# Altium schematic sheet CPU-board-Sheet2-multi.SchDoc: SM-CPU Board
size A3; Revision: rev. 0.1; SheetNumber: 2
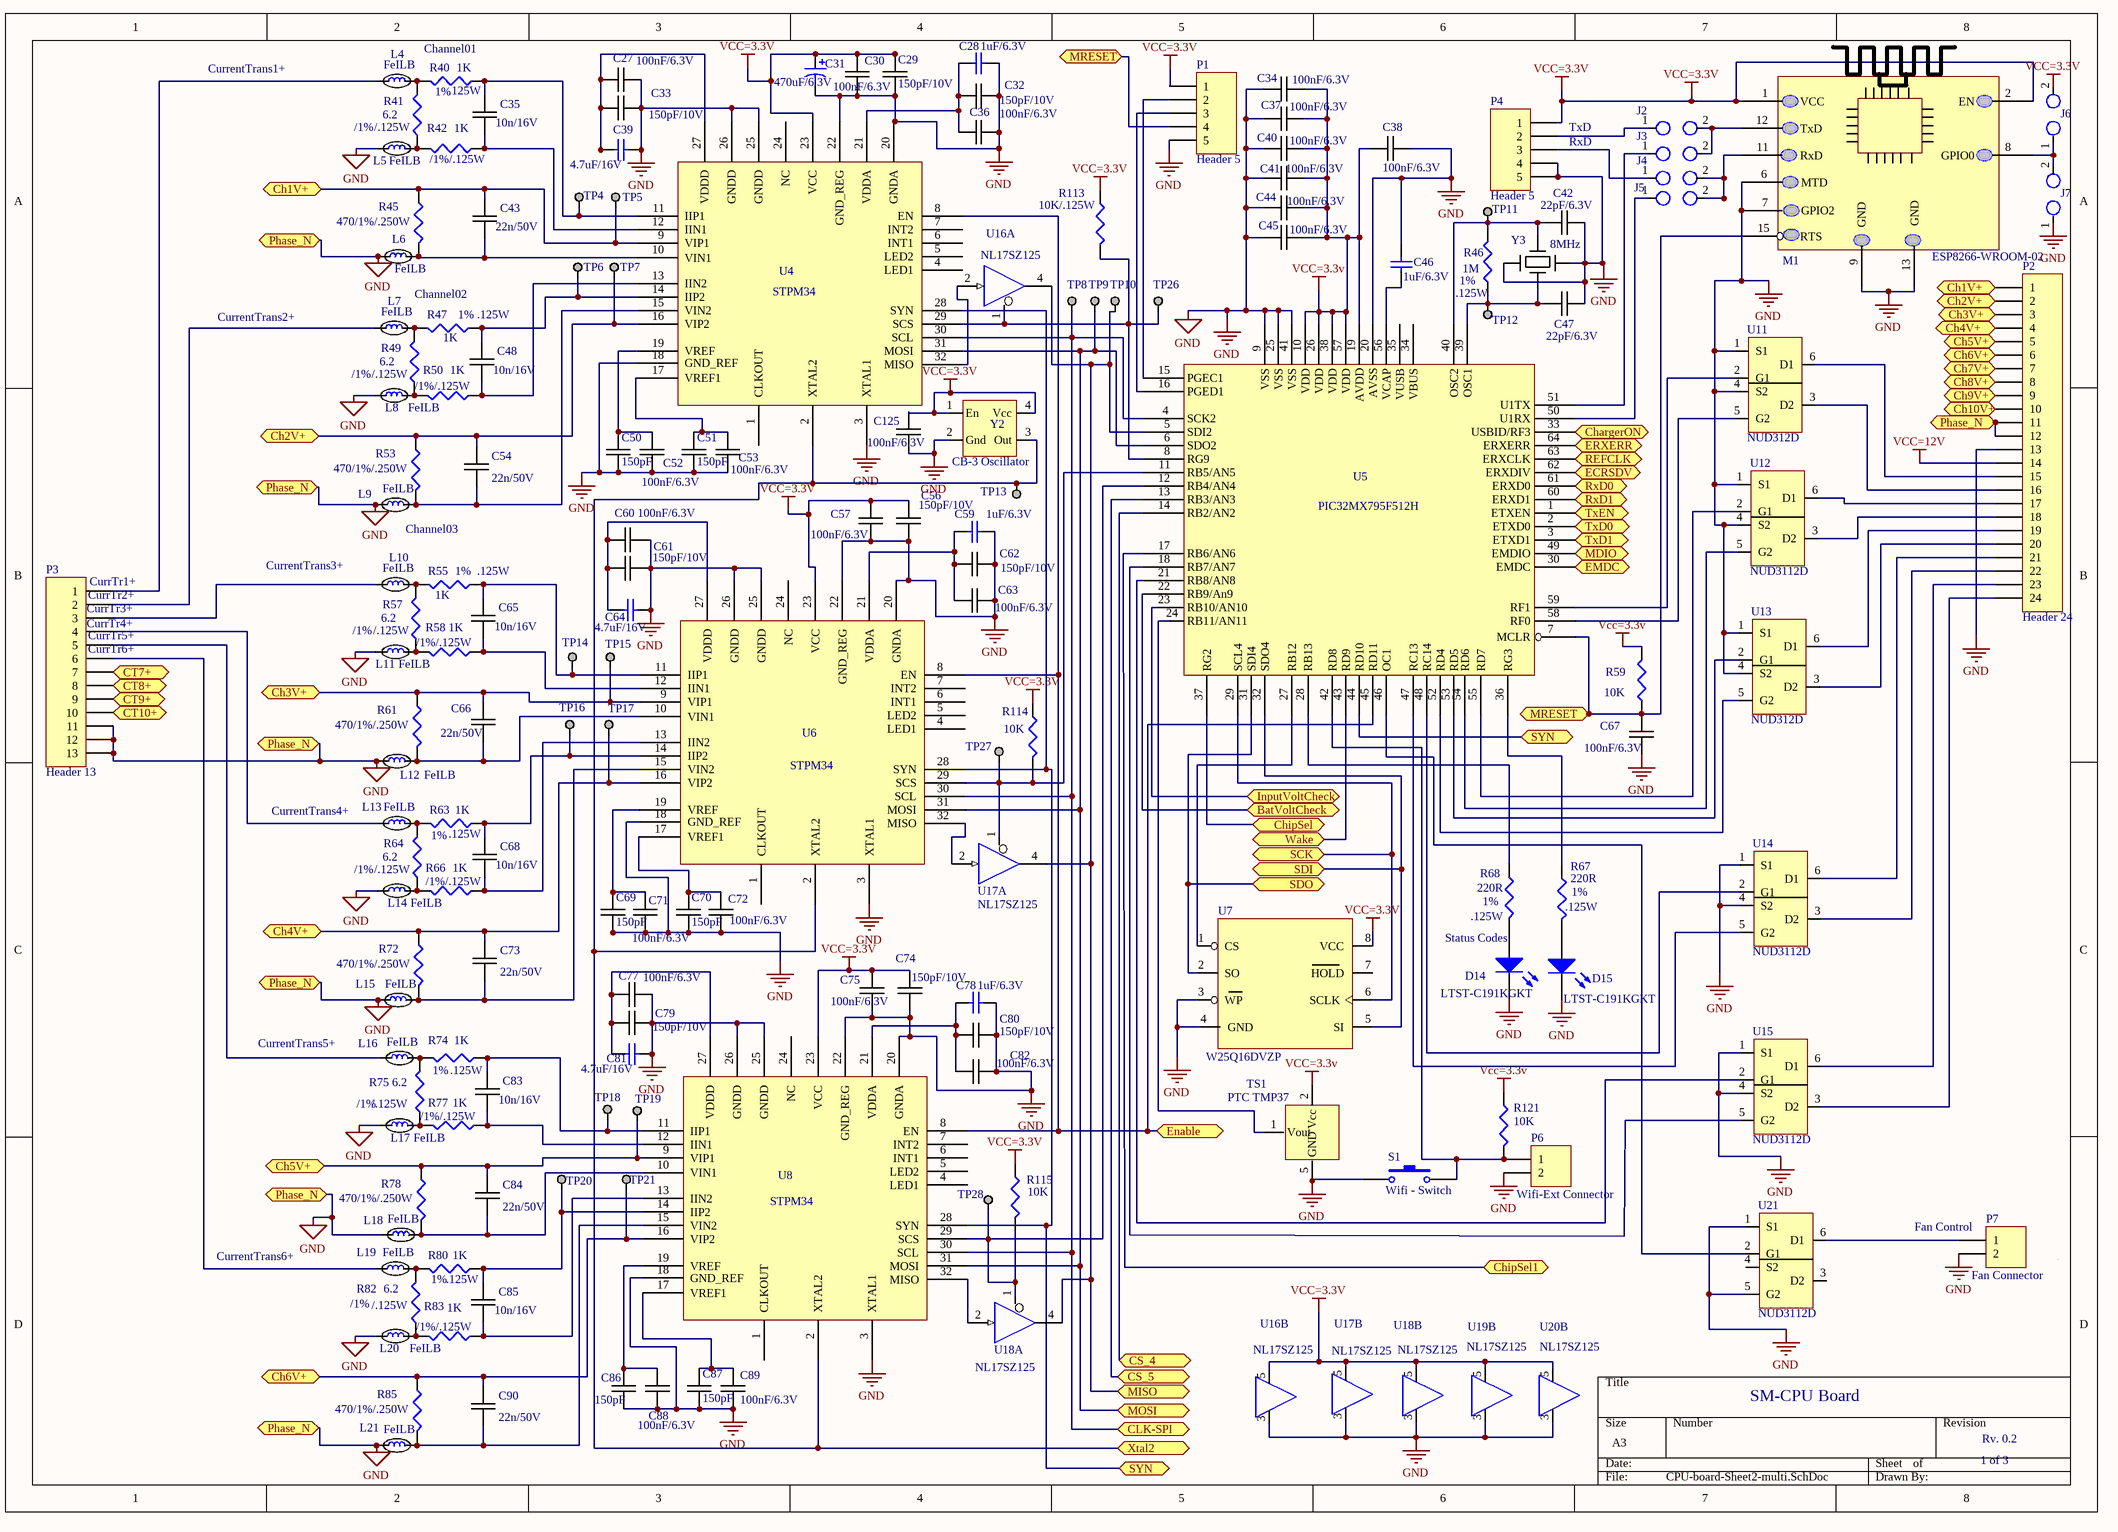
[diagram p0: CPU-board-Sheet2-multi.SchDoc]

## Parts
C27  100nF/6.3V  [0402C-GENERIC]
C28  1uF/6.3V  [0402C-GENERIC]
C29  150pF/10V  [0402C-GENERIC]
C30  100nF/6.3V  [0402C-GENERIC]
C31  470uF/6.3V  [470uF/6.3v]
C32  150pF/10V  [0402C-GENERIC]
C33  150pF/10V  [0402C-GENERIC]
C34  100nF/6.3V  [0402C-GENERIC]
C35  10n/16V  [0402C-GENERIC]
C36  100nF/6.3V  [0402C-GENERIC]
C37  100nF/6.3V  [0402C-GENERIC]
C38  100nF/6.3V  [0402C-GENERIC]
C39  4.7uF/16V  [0402C-GENERIC]
C40  100nF/6.3V  [0402C-GENERIC]
C41  100nF/6.3V  [0402C-GENERIC]
C42  22pF/6.3V  [0402C-GENERIC]
C43  22n/50V  [0402C-GENERIC]
C44  100nF/6.3V  [0402C-GENERIC]
C45  100nF/6.3V  [0402C-GENERIC]
C46  1uF/6.3V  [0402C-GENERIC]
C47  22pF/6.3V  [0402C-GENERIC]
C48  10n/16V  [0402C-GENERIC]
C50  150pF  [0402C-GENERIC]
C51  150pF  [0402C-GENERIC]
C52  100nF/6.3V  [0402C-GENERIC]
C53  100nF/6.3V  [0402C-GENERIC]
C54  22n/50V  [0402C-GENERIC]
C56  150pF/10V  [0402C-GENERIC]
C57  100nF/6.3V  [0402C-GENERIC]
C59  1uF/6.3V  [0402C-GENERIC]
C60  100nF/6.3V  [0402C-GENERIC]
C61  150pF/10V  [0402C-GENERIC]
C62  150pF/10V  [0402C-GENERIC]
C63  100nF/6.3V  [0402C-GENERIC]
C64  4.7uF/16V  [0402C-GENERIC]
C65  10n/16V  [0402C-GENERIC]
C66  22n/50V  [0402C-GENERIC]
C67  100nF/6.3V  [0402C-GENERIC]
C68  10n/16V  [0402C-GENERIC]
C69  150pF  [0402C-GENERIC]
C70  150pF  [0402C-GENERIC]
C71  100nF/6.3V  [0402C-GENERIC]
C72  100nF/6.3V  [0402C-GENERIC]
C73  22n/50V  [0402C-GENERIC]
C74  150pF/10V  [0402C-GENERIC]
C75  100nF/6.3V  [0402C-GENERIC]
C77  100nF/6.3V  [0402C-GENERIC]
C78  1uF/6.3V  [0402C-GENERIC]
C79  150pF/10V  [0402C-GENERIC]
C80  150pF/10V  [0402C-GENERIC]
C81  4.7uF/16V  [0402C-GENERIC]
C82  100nF/6.3V  [0402C-GENERIC]
C83  10n/16V  [0402C-GENERIC]
C84  22n/50V  [0402C-GENERIC]
C85  10n/16V  [0402C-GENERIC]
C86  150pF  [0402C-GENERIC]
C87  150pF  [0402C-GENERIC]
C88  100nF/6.3V  [0402C-GENERIC]
C89  100nF/6.3V  [0402C-GENERIC]
C90  22n/50V  [0402C-GENERIC]
C125  100nF/6.3V  [0402C-GENERIC]
D14  LED2  [LED-SM]  (value not drawn)
D15  LED2  [LED-SM]  (value not drawn)
J2  Header1x1  [HDR1X2]  (value not drawn)
J3  Header1x1  [HDR1X2]  (value not drawn)
J4  Header1x1  [HDR1X2]  (value not drawn)
J5  Header1x1  [HDR1X2]  (value not drawn)
J6  Header1x1  [HDR1X2]  (value not drawn)
J7  Header1x1  [HDR1X2]  (value not drawn)
L4  FeILB  [0603C-TBD]
L5  FeILB  [0603C-TBD]
L6  FeILB  [0603C-TBD]
L7  FeILB  [0603C-TBD]
L8  FeILB  [0603C-TBD]
L9  FeILB  [0603C-TBD]
L10  FeILB  [0603C-TBD]
L11  FeILB  [0603C-TBD]
L12  FeILB  [0603C-TBD]
L13  FeILB  [0603C-TBD]
L14  FeILB  [0603C-TBD]
L15  FeILB  [0603C-TBD]
L16  FeILB  [0603C-TBD]
L17  FeILB  [0603C-TBD]
L18  FeILB  [0603C-TBD]
L19  FeILB  [0603C-TBD]
L20  FeILB  [0603C-TBD]
L21  FeILB  [0603C-TBD]
M1  ESP8266-WROOM-02  [PCBComponent_1 - duplicate]
P1  Header 5  [HDR1X5]
P2  Header 24  [HDR1X24]
P3  Header 13
P4  Header 5  [HDR1X5]
P6  Wifi-Ext Connector  [HDR1X2]
P7  Fan Connector  [HDR1X2]
R40  1K  [0402R-TBD]
R41  6.2  [0402R-TBD]
R42  1K  [0402R-TBD]
R45  470/1%/.250W  [1206FB-GENERIC]
R46  1M  [0402R-TBD]
R47  1K  [0402R-TBD]
R49  6.2  [0402R-TBD]
R50  1K  [0402R-TBD]
R53  470/1%/.250W  [1206FB-GENERIC]
R55  1K  [0402R-TBD]
R57  6.2  [0402R-TBD]
R58  1K  [0402R-TBD]
R59  10K  [0402R-TBD]
R61  470/1%/.250W  [1206FB-GENERIC]
R63  1K  [0402R-TBD]
R64  6.2  [0402R-TBD]
R66  1K  [0402R-TBD]
R67  220R  [0402R-TBD]
R68  220R  [0402R-TBD]
R72  470/1%/.250W  [1206FB-GENERIC]
R74  1K  [0402R-TBD]
R75  6.2  [0402R-TBD]
R77  1K  [0402R-TBD]
R78  470/1%/.250W  [1206FB-GENERIC]
R80  1K  [0402R-TBD]
R82  6.2  [0402R-TBD]
R83  1K  [0402R-TBD]
R85  470/1%/.250W  [1206FB-GENERIC]
R113  10K/.125W  [0402C-GENERIC]
R114  10K  [0402C-GENERIC]
R115  10K  [0402C-GENERIC]
R121  10K  [0402R-TBD]
S1  Wifi - Switch  [SPST-2]
TP4  TESTPOINT  [TESTPOINT]  (value not drawn)
TP5  TESTPOINT  [TESTPOINT]  (value not drawn)
TP6  TESTPOINT  [TESTPOINT]  (value not drawn)
TP7  TESTPOINT  [TESTPOINT]  (value not drawn)
TP8  TESTPOINT  [TESTPOINT]  (value not drawn)
TP9  TESTPOINT  [TESTPOINT]  (value not drawn)
TP10  TESTPOINT  [TESTPOINT]  (value not drawn)
TP11  TESTPOINT  [TESTPOINT]  (value not drawn)
TP12  TESTPOINT  [TESTPOINT]  (value not drawn)
TP13  TESTPOINT  [TESTPOINT]  (value not drawn)
TP14  TESTPOINT  [TESTPOINT]  (value not drawn)
TP15  TESTPOINT  [TESTPOINT]  (value not drawn)
TP16  TESTPOINT  [TESTPOINT]  (value not drawn)
TP17  TESTPOINT  [TESTPOINT]  (value not drawn)
TP18  TESTPOINT  [TESTPOINT]  (value not drawn)
TP19  TESTPOINT  [TESTPOINT]  (value not drawn)
TP20  TESTPOINT  [TESTPOINT]  (value not drawn)
TP21  TESTPOINT  [TESTPOINT]  (value not drawn)
TP26  TESTPOINT  [TESTPOINT]  (value not drawn)
TP27  TESTPOINT  [TESTPOINT]  (value not drawn)
TP28  TESTPOINT  [TESTPOINT]  (value not drawn)
TS1  PTC TMP37
U4  STPM34  [QFN32_L]
U5  PIC32MX795F512H  [QFN64_N]
U6  STPM34  [QFN32_L]
U7  W25Q16DVZP  [SO8_L]
U8  STPM34  [QFN32_L]
U11  NUD312D  [NUD3112D]
U12  NUD3112D  [NUD3112D]
U13  NUD312D  [NUD3112D]
U14  NUD3112D  [NUD3112D]
U15  NUD3112D  [NUD3112D]
U16  NL17SZ125  (parts A,B of 2)
U17  NL17SZ125  (parts A,B of 2)
U18  NL17SZ125  (parts A,B of 2)
U19  NL17SZ125  (part B of 2)
U20  NL17SZ125  (part B of 2)
U21  NUD3112D  [NUD3112D]
Y2  CB-3 Oscillator  [CB3-16MHZ]
Y3  8MHz  [CeramicResonator8-16MHZ]

## Ports
BatVoltCheck, Ch1V+, Ch2V+, Ch3V+, Ch4V+, Ch5V+, Ch6V+, Ch7V+, Ch8V+, Ch9V+, Ch10V+, ChargerON, ChipSel, ChipSel1, CLK-SPI, CS_4, CS_5, CT7+, CT8+, CT9+, CT10+, ECRSDV, EMDC, Enable, ERXERR, InputVoltCheck, MDIO, MISO, MOSI, MRESET, Phase_N, REFCLK, RxD0, RxD1, SCK, SDI, SDO, SYN, TxD0, TxD1, TxEN, Wake, Xtal2

## Nets
GND: C27.2 C28.2 C29.2 C30.2 C31.2 C32.2 C33.2 C34.1 C36.2 C37.1 C38.2 C39.2 C40.1 C41.1 C42.2 C44.1 C45.1 C46.2 C47.2 C50.2 C51.2 C52.1 C53.2 C56.2 C57.2 C59.2 C60.2 C61.2 C62.2 C63.2 C64.2 C67.2 C69.2 C70.2 C71.2 C72.2 C74.2 C75.2 C77.2 C78.2 C79.2 C80.2 C81.2 C82.2 C86.2 C87.2 C88.2 C89.2 C125.1 D14.2(K) D15.2(K) J7.1 L5.1 L6.1 L8.1 L9.1 L11.1 L12.1 L14.1 L15.1 L17.1 L18.1 L20.1 L21.1 M1.6(MTD) M1.7(GPIO2) M1.9(GND) M1.13(GND) P1.5 P2.11 P2.12 P2.13 P3.11 P3.12 P3.13 P4.4 P4.5 P6.2 P7.2 S1.1 TS1.5(GND) U4.3(XTAL1) U4.18(GND_REF) U4.20(GNDA) U4.22(GND_REG) U4.25(GNDD) U4.26(GNDD) U5.9(VSS) U5.20(AVSS) U5.25(VSS) U5.41(VSS) U6.3(XTAL1) U6.18(GND_REF) U6.20(GNDA) U6.22(GND_REG) U6.25(GNDD) U6.26(GNDD) U7.3(WP) U7.4(GND) U8.3(XTAL1) U8.18(GND_REF) U8.20(GNDA) U8.22(GND_REG) U8.25(GNDD) U8.26(GNDD) U11.1(S1) U11.4(S2) U12.1(S1) U12.4(S2) U13.1(S1) U13.4(S2) U14.1(S1) U14.4(S2) U15.1(S1) U15.4(S2) U16.3 U17.3 U18.3 U19.3 U20.3 U21.1(S1) U21.5(G2) Y2.2(Gnd) Y3.2 Y3.4 ; port Phase_N
VCC=3.3V: C29.1 C30.1 C31.1 C34.2 C37.2 C38.1 C40.2 C41.2 C44.2 C45.2 C56.1 C57.1 C74.1 C75.1 C125.2 J6.2 M1.1(VCC) M1.2(EN) P1.1 P4.1 R59.2 R113.1 R114.1 R115.1 R121.1 TS1.2(Vcc) U4.23(VCC) U5.10(VDD) U5.19(AVDD) U5.26(VDD) U5.38(VDD) U5.57(VDD) U6.23(VCC) U7.8(VCC) U8.23(VCC) U16.5 U17.5 U18.5 U19.5 U20.5 Y2.1(En) Y2.4(Vcc)
VCC=12V: P2.14
BatVoltCheck: U5.22(RB9/An9) ; port BatVoltCheck
Ch1V+: C43.2 P2.1 R45.1 TP5.1 U4.9(VIP1) ; port Ch1V+
Ch2V+: C54.2 P2.2 R53.1 TP7.1 U4.16(VIP2) ; port Ch2V+
Ch3V+: C66.2 P2.3 R61.1 TP15.1 U6.9(VIP1) ; port Ch3V+
Ch4V+: C73.2 P2.4 R72.1 TP17.1 U6.16(VIP2) ; port Ch4V+
Ch5V+: C84.2 P2.5 R78.1 TP19.1 U8.9(VIP1) ; port Ch5V+
Ch6V+: C90.2 P2.6 R85.1 TP21.1 U8.16(VIP2) ; port Ch6V+
Ch7V+: P2.7 ; port Ch7V+
Ch8V+: P2.8 ; port Ch8V+
Ch9V+: P2.9 ; port Ch9V+
Ch10V+: P2.10 ; port Ch10V+
ChargerON: U5.33(USBID/RF3) ; port ChargerON
ChipSel: U5.37(RG2) ; port ChipSel
ChipSel1: U5.17(RB6/AN6) ; port ChipSel1
CLK-SPI: TP8.1 U4.30(SCL) U5.4(SCK2) U6.30(SCL) U8.30(SCL) ; port CLK-SPI
CS_4: U5.14(RB2/AN2) ; port CS_4
CS_5: U5.13(RB3/AN3) ; port CS_5
CT7+: P3.7 ; port CT7+
CT8+: P3.8 ; port CT8+
CT9+: P3.9 ; port CT9+
CT10+: P3.10 ; port CT10+
ECRSDV: U5.62(ERXDIV) ; port ECRSDV
EMDC: U5.30(EMDC) ; port EMDC
Enable: U4.8(EN) U6.8(EN) U8.8(EN) ; port Enable
ERXERR: U5.64(ERXERR) ; port ERXERR
InputVoltCheck: U5.23(RB10/AN10) ; port InputVoltCheck
MDIO: U5.49(EMDIO) ; port MDIO
MISO: TP10.1 U5.5(SDI2) U16.4(Y) U17.4(Y) U18.4(Y) ; port MISO
MOSI: TP9.1 U4.31(MOSI) U5.6(SDO2) U6.31(MOSI) U8.31(MOSI) ; port MOSI
MRESET: C67.1 M1.15(RTS) P1.4 R59.1 U5.7(MCLR) ; port MRESET
REFCLK: U5.63(ERXCLK) ; port REFCLK
RxD0: U5.61(ERXD0) ; port RxD0
RxD1: U5.60(ERXD1) ; port RxD1
SCK: U5.29(SCL4) U7.6(SCLK) ; port SCK
SDI: U5.32(SDO4) U7.5(SI) ; port SDI
SDO: U5.31(SDI4) U7.2(SO) ; port SDO
SYN: U4.28(SYN) U5.44(RD10) U6.28(SYN) U8.28(SYN) ; port SYN
TxD0: U5.2(ETXD0) ; port TxD0
TxD1: U5.3(ETXD1) ; port TxD1
TxEN: U5.1(ETXEN) ; port TxEN
Wake: U5.43(RD9) ; port Wake
Xtal2: TP13.1 U4.2(XTAL2) U6.2(XTAL2) U8.2(XTAL2) Y2.3(Out) ; port Xtal2
NetC27_1: C27.1 C33.1 C39.1 U4.27(VDDD)
NetC28_1: C28.1 C32.1 C36.1 U4.21(VDDA)
NetC35_1: C35.1 R42.1 U4.12(IIN1)
NetC35_2: C35.2 R40.1 TP4.1 U4.11(IIP1)
NetC42_1: C42.1 R46.2 TP11.1 U5.40(OSC2) Y3.1
NetC43_1: C43.1 L6.2 R45.2 U4.10(VIN1)
NetC46_1: C46.1 U5.56(VCAP)
NetC47_1: C47.1 R46.1 TP12.1 U5.39(OSC1) Y3.3
NetC48_1: C48.1 R50.1 U4.13(IIN2)
NetC48_2: C48.2 R47.1 TP6.1 U4.14(IIP2)
NetC50_1: C50.1 C52.2 U4.19(VREF)
NetC51_1: C51.1 C53.1 U4.17(VREF1)
NetC54_1: C54.1 L9.2 R53.2 U4.15(VIN2)
NetC59_1: C59.1 C62.1 C63.1 U6.21(VDDA)
NetC60_1: C60.1 C61.1 C64.1 U6.27(VDDD)
NetC65_1: C65.1 R58.1 U6.12(IIN1)
NetC65_2: C65.2 R55.1 TP14.1 U6.11(IIP1)
NetC66_1: C66.1 L12.2 R61.2 U6.10(VIN1)
NetC68_1: C68.1 R66.1 U6.13(IIN2)
NetC68_2: C68.2 R63.1 TP16.1 U6.14(IIP2)
NetC69_1: C69.1 C71.1 U6.19(VREF)
NetC70_1: C70.1 C72.1 U6.17(VREF1)
NetC73_1: C73.1 L15.2 R72.2 U6.15(VIN2)
NetC77_1: C77.1 C79.1 C81.1 U8.27(VDDD)
NetC78_1: C78.1 C80.1 C82.1 U8.21(VDDA)
NetC83_1: C83.1 R77.1 U8.12(IIN1)
NetC83_2: C83.2 R74.1 TP18.1 U8.11(IIP1)
NetC84_1: C84.1 L18.2 R78.2 U8.10(VIN1)
NetC85_1: C85.1 R83.1 U8.13(IIN2)
NetC85_2: C85.2 R80.1 TP20.1 U8.14(IIP2)
NetC86_1: C86.1 C88.1 U8.19(VREF)
NetC87_1: C87.1 C89.1 U8.17(VREF1)
NetC90_1: C90.1 L21.2 R85.2 U8.15(VIN2)
NetD14_1: D14.1(A) R68.2
NetD15_1: D15.1(A) R67.2
NetJ2_1: J2.1 P4.2
NetJ2_2: J2.2 J3.2 M1.12(TxD)
NetJ3_1: J3.1 U5.51(U1TX)
NetJ4_1: J4.1 P4.3
NetJ4_2: J4.2 J5.2 M1.11(RxD)
NetJ5_1: J5.1 U5.50(U1RX)
NetJ6_1: J6.1 J7.2 M1.8(GPIO0)
NetL4_1: L4.1 P3.1
NetL4_2: L4.2 R40.2 R41.2
NetL5_2: L5.2 R41.1 R42.2
NetL7_1: L7.1 P3.2
NetL7_2: L7.2 R47.2 R49.2
NetL8_2: L8.2 R49.1 R50.2
NetL10_1: L10.1 P3.3
NetL10_2: L10.2 R55.2 R57.2
NetL11_2: L11.2 R57.1 R58.2
NetL13_1: L13.1 P3.4
NetL13_2: L13.2 R63.2 R64.2
NetL14_2: L14.2 R64.1 R66.2
NetL16_1: L16.1 P3.5
NetL16_2: L16.2 R74.2 R75.2
NetL17_2: L17.2 R75.1 R77.2
NetL19_1: L19.1 P3.6
NetL19_2: L19.2 R80.2 R82.2
NetL20_2: L20.2 R82.1 R83.2
NetP1_2: P1.2 U5.15(PGEC1)
NetP1_3: P1.3 U5.16(PGED1)
NetP2_15: P2.15 U11.6(D1)
NetP2_16: P2.16 U11.3(D2)
NetP2_17: P2.17 U12.6(D1)
NetP2_18: P2.18 U12.3(D2)
NetP2_19: P2.19 U13.6(D1)
NetP2_20: P2.20 U13.3(D2)
NetP2_21: P2.21 U14.6(D1)
NetP2_22: P2.22 U14.3(D2)
NetP2_23: P2.23 U15.6(D1)
NetP2_24: P2.24 U15.3(D2)
NetP6_1: P6.1 R121.2 S1.2 U5.42(RD8)
NetP7_1: P7.1 U21.6(D1)
NetR67_1: R67.1 U5.36(RG3)
NetR68_1: R68.1 U5.28(RB13)
NetR113_2: R113.2 TP26.1 U4.29(SCS) U5.8(RG9) U16.1
NetR114_2: R114.2 TP27.1 U5.11(RB5/AN5) U6.29(SCS) U17.1
NetR115_2: R115.2 TP28.1 U5.12(RB4/AN4) U8.29(SCS) U18.1
NetTS1_1: TS1.1(Vout) U5.24(RB11/AN11)
NetU4_32: U4.32(MISO) U16.2(B)
NetU5_18: U5.18(RB7/AN7) U15.5(G2)
NetU5_21: U5.21(RB8/AN8) U15.2(G1)
NetU5_27: U5.27(RB12) U7.1(CS)
NetU5_46: U5.46(OC1) U21.2(G1)
NetU5_47: U5.47(RC13) U14.5(G2)
NetU5_48: U5.48(RC14) U14.2(G1)
NetU5_52: U5.52(RD4) U13.5(G2)
NetU5_53: U5.53(RD5) U13.2(G1)
NetU5_54: U5.54(RD6) U12.5(G2)
NetU5_55: U5.55(RD7) U12.2(G1)
NetU5_58: U5.58(RF0) U11.5(G2)
NetU5_59: U5.59(RF1) U11.2(G1)
NetU6_32: U6.32(MISO) U17.2(B)
NetU8_32: U8.32(MISO) U18.2(B)

Not connected (* = marked no-connect by the designer): U4 1(CLKOUT) 4(LED1) 5(LED2) 6(INT1) 7(INT2) 24(NC); U5 34(VBUS) 35(VUSB) 45(RD11); U6 1(CLKOUT) 4(LED1) 5(LED2) 6(INT1) 7(INT2) 24(NC); U7 7(HOLD); U8 1(CLKOUT) 4(LED1) 5(LED2) 6(INT1) 7(INT2) 24(NC); U21 3(D2) 4(S2)

## Notes on the sheet
- Channel01
- CurrentTrans1+
- (near R40) 1%
- (near R40) .125W
- (near L5) /1%
- /.125W
- (near R42) /1%/.125W
- (near P4) TxD
- (near P4) RxD
- CurrentTrans2+
- Channel02
- (near R47) 1%
- (near R47) .125W
- (near R46) .125W
- (near R46) 1%
- (near L8) /1%
- /1%/.125W
- (near P3) CurrTr1+
- (near L10) CurrentTrans3+
- (near L9) Channel03
- (near R55) 1%
- (near R55) .125W
- (near P3) CurrTr3+
- (near P3) CurrTr4+
- (near P3) CurrTr2+
- (near P3) CurrTr5+
- (near P3) CurrTr6+
- (near L11) /1%
- (near L13) CurrentTrans4+
- 1%
- .125W
- (near L14) /1%
- (near R66) /1%/.125W
- (near R68) .125W
- (near R68) 1%
- (near R67) .125W
- (near R67) 1%
- (near D14) LTST-C191KGKT
- Status Codes
- CurrentTrans5+
- (near D15) LTST-C191KGKT
- (near L17) /1%
- CurrentTrans6+
- (near P7) Fan Control
- /1%
- (near R82) /.125W
- (near R80) 1%
- SM-CPU Board
- 1 of 3
- Rv. 0.2

## Library data of the parts
C27 C30 C34 C36-C38 C40 C41 C44 C45 C52 C53 C57 C60 C63 C67 C71 C72 C75 C77 C82 C88 C89 C125 = 0805C-18PF-50V-C0G-JOH: CAPACITOR 0805 CERAMIC; mfr PN: LMK105BJ104KV-F; Manufacturer: Taiyo Yuden; Mfr.PN#: CRM155R71H103KA880; Value: 100nF/16V; Suppl.PN#: 587-1227-1-ND; Supplier 1: Digi-Key; Supplier Part Number 1: 709-1171-2-ND; Package reference: 0805-TBD; Supplier: Digi-Key; PackageReference: 0402; Price: .002
C28 C46 C59 C78 = Cap: Capacitor; Manufacturer: Murata; Mfr.PN#: GRM155R60J105KE19D; Value: 1uF; Suppl.PN#: 490-1320-1-ND; Published: 8-Jun-2000; LatestRevisionDate: 17-Jul-2002; LatestRevisionNote: Re-released for DXP Platform.; PackageReference: 0402; Publisher: Altium Limited; PackageDescription: Radial Cap, Thru-Hole; 2 Leads; 0.3 in Pin Spacing; Supplier: DigiKey
C29 C32 C33 C56 C61 C62 C74 C79 C80 = 0805C-18PF-50V-C0G-JOH: CAPACITOR 0805 CERAMIC; Manufacturer: Wurth Electronics; Mfr.PN#: 885012005014; Suppl.PN#: 732-7432-1-ND; Supplier 1: Digi-Key; Supplier Part Number 1: 709-1171-2-ND; Value: 150pF/10V; mfr PN: *; Supplier: Digi-Key; Price: .002
  C29 C33: PackageReference: 0402; smd: 0402
  C32: Package reference: 0805-TBD; smd: 0402
  C56 C61 C62 C74 C79 C80: Package reference: 0805-TBD; PackageReference: 0402
C31 = Cap Pol3: Polarized Capacitor (Surface Mount); Manufacturer: Nichicon; Mfr.PN#: RL80J471MDNASQKX; Value: 100uF/10v; Suppl.PN#: 493-4019-3-ND; Published: 8-Jun-2000; LatestRevisionDate: 29-May-2009; LatestRevisionNote: IPC-7351 Footprint Added.; PackageReference: Radial Can; Publisher: Altium Limited; PackageDescription: Chip Capacitor; Supplier: Digi-Key; SMD: 1206; Price: .065
C35 C48 C65 C68 C83 C85 = 0805C-18PF-50V-C0G-JOH: CAPACITOR 0805 CERAMIC; Manufacturer: Murata Electronics; Mfr.PN#: GRM155R71C103KA01D; Value: 10n; Suppl.PN#: 490-1313-1-ND; Supplier 1: Digi-Key; Supplier Part Number 1: 709-1171-2-ND; mfr PN: *; PackageReference: 0402; Supplier: Digi-Key; Price: .002
  C35 C68 C83 C85: Suppl.PN#: GRM155R71C103KA01D; smd: 0402
  C48: Package reference: 0402; Suppl.PN#: GRM155R71C103KA01D
  C65: Package reference: 0805-TBD
C39 C64 C81 = Cap: Capacitor; Manufacturer: Samsung; Mfr.PN#: CL05A475MO5NUNC; Value: 1uF; Suppl.PN#: 1276-6836-1-ND; Published: 8-Jun-2000; LatestRevisionDate: 17-Jul-2002; LatestRevisionNote: Re-released for DXP Platform.; PackageReference: 0402; Publisher: Altium Limited; PackageDescription: Radial Cap, Thru-Hole; 2 Leads; 0.3 in Pin Spacing; Supplier: DigiKey
C42 = 0805C-18PF-50V-C0G-JOH: CAPACITOR 0805 CERAMIC; Manufacturer: Murata; Mfr.PN#: GRM1555C1E120JA01D; Suppl.PN#: 490-8170-1-ND; Supplier 1: Digi-Key; Supplier Part Number 1: 709-1171-2-ND; Supplier: DigiKey; PackageReference: 0402
C43 C54 C66 C73 C84 C90 = 0805C-18PF-50V-C0G-JOH: CAPACITOR 0805 CERAMIC; Manufacturer: Murata Electronics; Mfr.PN#: GRM155R71H223KA12D; Value: 10n; Suppl.PN#: 490-3884-1-ND; Supplier 1: Digi-Key; Supplier Part Number 1: 709-1171-2-ND; mfr PN: *; Package reference: 0402; Supplier: Digi-Key; PackageReference: 0402; Price: .002
C47 = 0805C-18PF-50V-C0G-JOH: CAPACITOR 0805 CERAMIC; Manufacturer: Murata; Mfr.PN#: GRM1555C1E120JA01D; Suppliier: DigiKey; Suppl.PN#: 490-8170-1-ND; Supplier 1: Digi-Key; Supplier Part Number 1: 709-1171-2-ND; PackageReference: 0402
C50 C51 C69 C70 C86 C87 = 0805C-18PF-50V-C0G-JOH: CAPACITOR 0805 CERAMIC; Manufacturer: Wurth Electronics; Mfr.PN#: 885012005014; Value: 150pF/10V; Suppl.PN#: 732-7432-1-ND; Supplier 1: Digi-Key; Supplier Part Number 1: 709-1171-2-ND; mfr PN: *; PackageReference: 0402; Supplier: Digi-Key; smd: 0402; Price: .002
D14 D15 = LED2: Typical RED, GREEN, YELLOW, AMBER GaAs LED; Manufacturer: Lite-On Inc; Mfr.PN#: LTST-C191KGKT; Suppl.PN#: 160-1446-2-ND; Published: 8-Jun-2000; LatestRevisionDate: 17-Jul-2002; LatestRevisionNote: Re-released for DXP Platform.; PackageVersion: Feb-2002; PackageReference: 0603; Publisher: Altium Limited; PackageDescription: SM LED; 2 Flat Leads; Supplier: Digi-Key; Price: .04
J2-J7 = Header1x1: Suppl.PN#: S9014E-05-ND; Supplier: Digikey
L4-L21 = FerrBeads/ILBB: Manufacturer: Brand Samsung; Mfr.PN#: C1M10J152NC; Suppl.PN#: 1276-6326-1-ND; Supplier: Digi-Key; Price: .027
  L4-L7: PackageReference: 0603
M1 = ESP 8266: Supplier: Alixpress; Suppl.PN#: ESP8266-WROOM-02; Link: https://www.aliexpress.com/store/product/ESP8266-serial-WIFI-model-ESP-WROOM-02-Authenticity-Guaranteed/431798_32319251013.html
P1 P4 = Header 5: Header, 5-Pin; Suppl.PN#: S9014E-05-ND; LatestRevisionDate: 17-Jul-2002; LatestRevisionNote: Re-released for DXP Platform.; Publisher: Altium Limited; Supplier: Optional depend of debugger; Supplier: Digikey
P2 = Header 24: Header, 24-Pin; Manufacturer: Sullins Connector Solution; Mfr.PN#: PPPC241LFBN-RC; Suppl.PN#: S7057-ND; LatestRevisionDate: 17-Jul-2002; LatestRevisionNote: Re-released for DXP Platform.; Publisher: Altium Limited; Supplier: Digikey
P3 = Header 13: Header, 13-Pin; Mfr.PN#: PPPC131LFBN-RC; Manufacturer: Sullins Connector Solution; Suppl.PN#: S7046-ND; LatestRevisionNote: Re-released for DXP Platform.; Publisher: Altium Limited; Supplier: Digikey
P6 P7 = Header 2: Header, 2-Pin; Suppl.PN#: S9014E-05-ND; LatestRevisionDate: 17-Jul-2002; LatestRevisionNote: Re-released for DXP Platform.; Publisher: Altium Limited; Supplier: Digikey
R40 R42 R47 R50 R55 R58 R63 R66 R74 R77 R80 R83 = Res3: Resistor; Manufacturer: Panasonic; Mfr.PN#: ERJ-2RKF1001X; Suppl.PN#: P1.00KLCT-ND; Published: 8-Jun-2000; LatestRevisionDate: 29-May-2009; LatestRevisionNote: IPC-7351 Footprint Added.; PackageReference: 0402; Publisher: Altium Limited; PackageDescription: Chip Resistor; Value: 1K; Supplier: DigiKey; Price: .0035
R41 R49 R57 R64 R75 R82 = Res3: Resistor; Manufacturer: Vishay Dale; Mfr.PN#: CRCW04026R20FKED; Value: 18.7 1%; Suppl.PN#: 541-6.20LLCT-ND; Published: 8-Jun-2000; LatestRevisionDate: 29-May-2009; LatestRevisionNote: IPC-7351 Footprint Added.; PackageReference: 0402; Publisher: Altium Limited; PackageDescription: Chip Resistor; Supplier: Digi-Key; Price: .05; SMD: 0402
R45 R53 R61 R72 R78 R85 = Res3: Resistor; Manufacturer: Vishay/Draloric; Mfr.PN#: SMM02040C4700FB300; Value: 470 1%/.250W; Suppl.PN#: 71-SMM0204-F-470; Published: 8-Jun-2000; LatestRevisionDate: 29-May-2009; LatestRevisionNote: IPC-7351 Footprint Added.; Publisher: Altium Limited; PackageDescription: Chip Resistor; Supplier: Mouser; SMD: 1206; Price: .02; PackageReference: 1206
R46 = Res3: Resistor; Manufacturer: Panasonic; Mfr.PN#: ERJ-2RKF1004X; Value: 1K 1%; Suppl.PN#: P1.00MLTR-ND; Published: 8-Jun-2000; LatestRevisionDate: 29-May-2009; LatestRevisionNote: IPC-7351 Footprint Added.; PackageReference: 0402; Publisher: Altium Limited; PackageDescription: Chip Resistor; manufacture P/N: *; Supplier: Digi-Key; Price: .0027
R59 R121 = Res3: Resistor; Manufacturer: Panasonic; Mfr.PN#: ERJ-2RKF1002X; Value: 100K; Suppl.PN#: P10.0KLTR-ND; Published: 8-Jun-2000; LatestRevisionDate: 29-May-2009; LatestRevisionNote: IPC-7351 Footprint Added.; PackageReference: 0402; Publisher: Altium Limited; PackageDescription: Chip Resistor; Supplier: Digi-Key; Price: .0035
R67 R68 = Res3: Resistor; Manufacturer: Panasonic; Mfr.PN#: ERJ-2RKF1001X; Value: 1K; Suppl.PN#: P1.00KLCT-ND; Published: 8-Jun-2000; LatestRevisionDate: 29-May-2009; LatestRevisionNote: IPC-7351 Footprint Added.; PackageReference: 0402; Publisher: Altium Limited; PackageDescription: Chip Resistor; Supplier: DigiKey; Price: .0035
R113 = Res3: Resistor; Manufacturer: Panasonic; Mfr.PN#: ERJ-2RKF1002X; Value: 10k; Suppl.PN#: P10.0KLCT-ND; Published: 8-Jun-2000; LatestRevisionDate: 29-May-2009; LatestRevisionNote: IPC-7351 Footprint Added.; Publisher: Altium Limited; PackageDescription: Chip Resistor; Supplier: Digikey; SMD: 0402; Price: .02; PackageReference: 0402
R114 = Res3: Resistor; Manufacturer: Panasonic; Mfr.PN#: ERJ-2RKF1002X; Suppl.PN#: P10.0KLCT-ND; Published: 8-Jun-2000; LatestRevisionDate: 29-May-2009; LatestRevisionNote: IPC-7351 Footprint Added.; Publisher: Altium Limited; PackageDescription: Chip Resistor; Value: 10k; Supplier: Digikey; SMD: 0402; Price: .02; PackageReference: 0402
R115 = Res3: Resistor; Manufacturer: Panasonic; Mfr.PN#: ERJ-2RKF1002X; Value: 10k/1%/.125W; Suppl.PN#: P10.0KLCT-ND; Published: 8-Jun-2000; LatestRevisionDate: 29-May-2009; LatestRevisionNote: IPC-7351 Footprint Added.; Publisher: Altium Limited; PackageDescription: Chip Resistor; Supplier: Digikey; SMD: 0402; Price: .02; PackageReference: 0402
S1 = SW-PB: Switch; Manufacturer: Digibay; Mfr.PN#: SE-DE01-09-0157; Published: 24-Mar-1999; LatestRevisionDate: 17-Jul-2002; LatestRevisionNote: Re-released for DXP Platform.; PackageReference: SPST-2; Publisher: Altium Limited; PackageDescription: Switch; 2 Leads; Link: http://www.digibay.in/157-smd-tactile-micro-push-button-switch
TP4-TP21 TP26-TP28 = TESTPOINT: TESTPOINT SCOPE GRABBER; Manufacturer Part Number: 5010; Manufacturer: Keystone Electronics; Reel: TH; Supplier 1: Digi-Key; Supplier Part Number 1: 5010K-ND
TS1 = PTC TPM37: Manufacturer: Analog Devices; Mfr.PN#: TMP37GRTZ-REEL7; Suppl.PN#: TMP37GRTZ-REEL7CT-ND; Supplier: Digikey
U4 = STPM34: Manufacturer: STMicroelectronics; Mfr.PN#: STPM34TR; Suppl.PN#: 497-14670-1-ND; ReferencePackage: QFN32; Supplier: DigiKey
U5 = PIC32MX534F064F: Manufacturer: Microchip; Mfr.PN#: PIC32MX795F512H-80I/PT; Suppl.PN#: PIC32MX795F512H-80I/PT-ND; Supplier: Digikey
U7 = 23LCV1024: Manufacturer: Winbond Electronics; Mfr.PN#: W25Q16DVZPIG; Suppl.PN#: W25Q16DVZPIG-ND; Supplier: DigiKey; PackageReference: 8-SOIC
U11-U15 U21 = NUD312D: Manufacturer: On Semi; Mfr.PN#: NUD3112DMT1G; Suppl.PN#: NUD3112DMT1GOSCT-ND; Supplier: Digikey
U16-U18 = NL17SZ125: Tristate Single Buffer; Manufacturer: ON Semi; Mfr.PN#: NL17SZ125DTT1G; Suppl.PN#: NL17SZ125DTT1GOSCT-ND; Supplier: Digikey; Footprint: TSOP-5 case 483
U19 U20 = NL17SZ125: Tristate Single Buffer
Y2 = CB-3 Oscillator: Manufacturer: CTS Electronics Component; Mfr.PN#: 632L3I016M00000; Suppl.PN#: 774-632L3I016M00000; Supplier: Mouser
Y3 = 12MC-HC49US-7MM: 12MHz CRYSTAL HC49US SHORT BODY; Manufacturer: KDS DAISHINKU.Corp; Mfr.PN#: DSX321G-8MHz; Supplier 1: Mouser; Supplier Part Number 1: 520-120-20-3XT; Supplier: KDS DAISHINKU.Corp; Suppl.PN#: DSX321G-8MHz